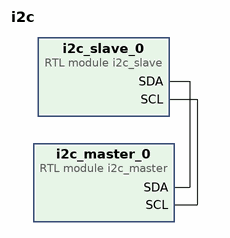
[diagram p0: block diagram of the top level]
# Vivado block design i2c, xc7z020clg400-1, Vivado 2022.2
create_bd_design i2c

create_bd_cell -type module -reference i2c_master i2c_master_0
create_bd_cell -type module -reference i2c_slave i2c_slave_0

# ---- connections ----

connect_bd_net [get_bd_pins i2c_master_0/SDA] [get_bd_pins i2c_slave_0/SDA]
connect_bd_net [get_bd_pins i2c_master_0/SCL] [get_bd_pins i2c_slave_0/SCL]

validate_bd_design
save_bd_design
